# EAGLE design main (EAGLE 9.6.2)
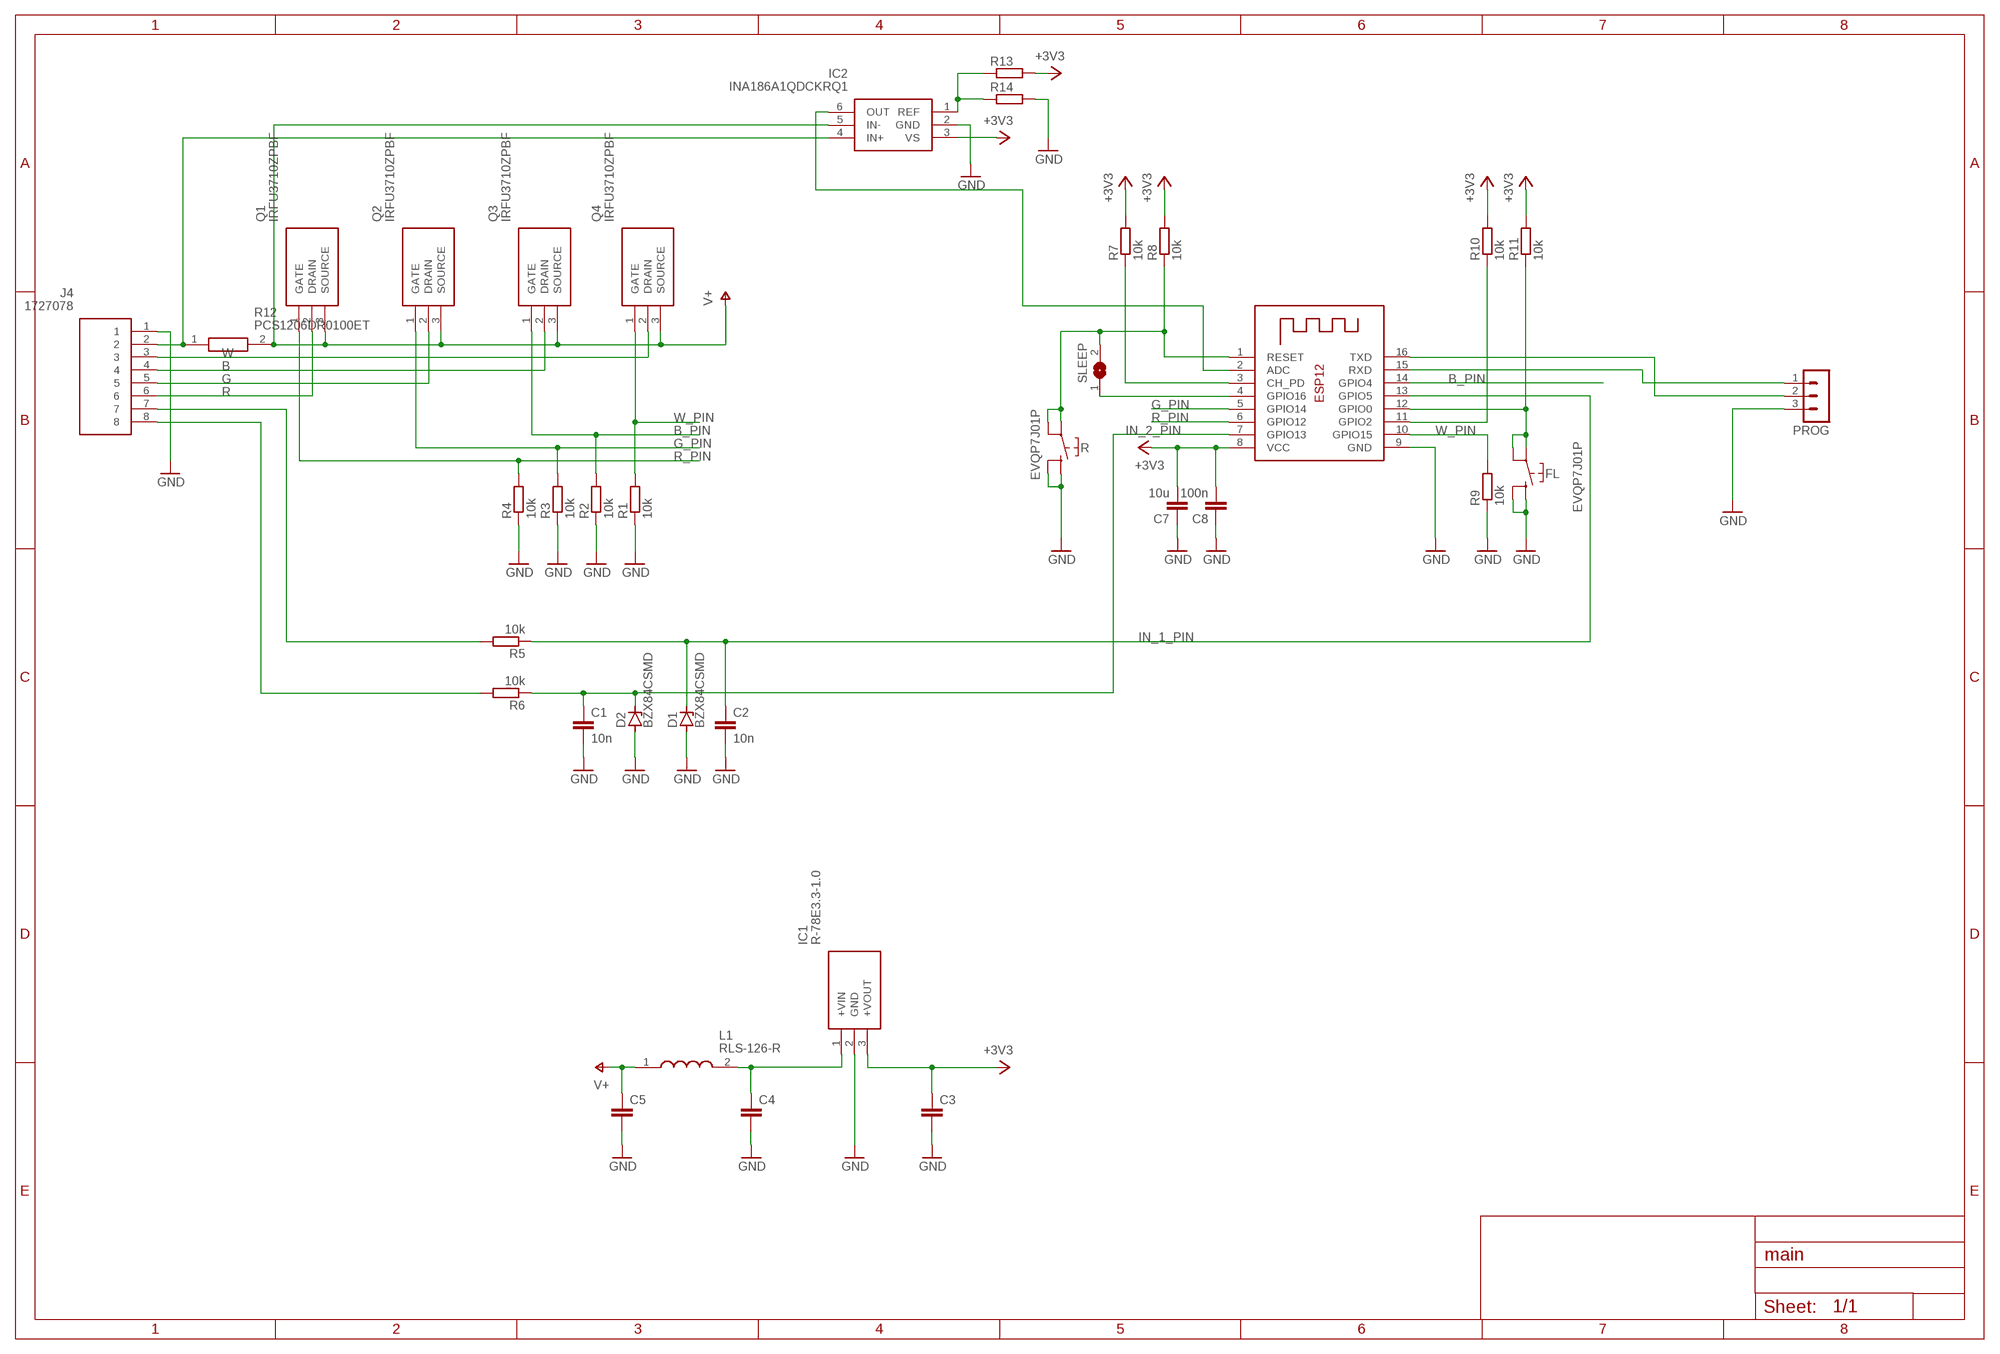
[diagram p0: schematic, sheet 1]

## Parts
C1  10n  C-EUC0603  [C0603]
C2  10n  C-EUC0603  [C0603]
C3  C-EUC0603  [C0603]
C4  C-EUC1206  [C1206]
C5  C-EUC1206  [C1206]
C7  10u  C-EUC0603  [C0603]
C8  100n  C-EUC0603  [C0603]
D1  BZX84CSMD  [TO236]
D2  BZX84CSMD  [TO236]
FL  EVQP7J01P  [EVQP7J01P]
IC1  R-78E3.3-1.0  [R78E3310]
IC2  INA186A1QDCKRQ1  [SOP65P210X110-6N]
J4  1727078  [SHDR8W90P0X381_1X8_3047X730X86]
L1  RLS-126-R  [RLS126R]
PROG  MA03-1  [MA03-1]
Q1  IRFU3710ZPBF  [TO229P239X654X978-3P]
Q2  IRFU3710ZPBF  [TO229P239X654X978-3P]
Q3  IRFU3710ZPBF  [TO229P239X654X978-3P]
Q4  IRFU3710ZPBF  [TO229P239X654X978-3P]
R  EVQP7J01P  [EVQP7J01P]
R1  10k  R-EU_R0603  [R0603]
R2  10k  R-EU_R0603  [R0603]
R3  10k  R-EU_R0603  [R0603]
R4  10k  R-EU_R0603  [R0603]
R5  10k  R-EU_R0603  [R0603]
R6  10k  R-EU_R0603  [R0603]
R7  10k  R-EU_R0603  [R0603]
R8  10k  R-EU_R0603  [R0603]
R9  10k  R-EU_R0603  [R0603]
R10  10k  R-EU_R0603  [R0603]
R11  10k  R-EU_R0603  [R0603]
R12  PCS1206DR0100ET  [RESC3216X68N]
R13  R-EU_R0402  [R0402]
R14  R-EU_R0402  [R0402]
SLEEP  SJ  [SJ]
X2  ESP-12  [ESP-12]

## Nets
+3V3: C3.1 C7.2 C8.2 IC1.3(+VOUT) IC2.3(VS) R7.2 R8.2 R10.2 R11.2 R13.2 X2.8(VCC)
B: J4.4 Q3.2(DRAIN)
B_PIN: Q3.1(GATE) R2.2 X2.14(GPIO4)
G: J4.5 Q2.2(DRAIN)
G_PIN: Q2.1(GATE) R3.2 X2.5(GPIO14)
GND: C1.2 C2.2 C3.2 C4.2 C5.2 C7.1 C8.1 D1.A D2.A FL.A2(COM_1) FL.B2(COM_2) IC1.2(GND) IC2.2(GND) J4.1 PROG.3 R1.1 R2.1 R3.1 R4.1 R9.1 R14.2 R.A2(COM_1) R.B2(COM_2) X2.9(GND)
IN_1_PIN: C2.1 D1.C R5.1 X2.13(GPIO5)
IN_2_PIN: C1.1 D2.C R6.1 X2.7(GPIO13)
N$1: IC2.6(OUT) X2.2(ADC)
N$3: R8.1 R.A1(NO_1) R.B1(NO_2) SLEEP.2 X2.1(RESET)
N$4: J4.7 R5.2
N$5: J4.8 R6.2
N$6: PROG.1 X2.15(RXD)
N$7: IC2.4(IN+) J4.2 R12.1
N$8: IC2.1(REF) R13.1 R14.1
N$9: C4.1 IC1.1(+VIN) L1.2
N$10: R7.1 X2.3(CH_PD)
N$11: R10.1 X2.11(GPIO2)
N$13: FL.A1(NO_1) FL.B1(NO_2) R11.1 X2.12(GPIO0)
N$17: PROG.2 X2.16(TXD)
N$21: SLEEP.1 X2.4(GPIO16)
R: J4.6 Q1.2(DRAIN)
R_PIN: Q1.1(GATE) R4.2 X2.6(GPIO12)
V+: C5.1 IC2.5(IN-) L1.1 Q1.3(SOURCE) Q2.3(SOURCE) Q3.3(SOURCE) Q4.3(SOURCE) R12.2
W: J4.3 Q4.2(DRAIN)
W_PIN: Q4.1(GATE) R1.2 R9.2 X2.10(GPIO15)

## Library data of the parts
C1-C5 C7 C8 = rcl:C-EU: CAPACITOR, European symbol; SPICEPREFIX: C
D1 D2 = diode:BZX84CSMD: Z DIODE
FL R = SamacSys_Parts:EVQP7J01P: PANASONIC - EVQP7J01P - TACTILE SW, SPST-NO, 0.05A, 12V, SMD Source: Datasheet <https://www.arrow.com/en/products/evq-p7j01p/panasonic>; ARROW_PART_NUMBER: EVQP7J01P; ARROW_PRICE-STOCK: https://www.arrow.com/en/products/evq-p7j01p/panasonic; DESCRIPTION: PANASONIC - EVQP7J01P - TACTILE SW, SPST-NO, 0.05A, 12V, SMD; HEIGHT: 1.35mm; MANUFACTURER_NAME: Panasonic; MANUFACTURER_PART_NUMBER: EVQP7J01P
IC1 = SamacSys_Parts:R-78E3.3-1.0: Recom DC-DC Switching Regulator, 7 28V dc Input, 3.3V Output, 1A Source: Datasheet <https://componentsearchengine.com/Datasheets/1/R-78E3.3-1.0.pdf>; ARROW_PART_NUMBER: R-78E3.3-1.0; ARROW_PRICE-STOCK: https://www.arrow.com/en/products/r-78e3.3-1.0/recom-power; DESCRIPTION: Recom DC-DC Switching Regulator, 7 28V dc Input, 3.3V Output, 1A; HEIGHT: 10.9mm; MANUFACTURER_NAME: RECOM Power; MANUFACTURER_PART_NUMBER: R-78E3.3-1.0; MOUSER_PART_NUMBER: 919-R-78E3.3-1.0; MOUSER_PRICE-STOCK: https://www.mouser.co.uk/ProductDetail/RECOM-Power/R-78E33-10/?qs=D0iH%252BVFiYPOgLjjtWWnV0Q%3D%3D
IC2 = SamacSys_Parts:INA186A1QDCKRQ1: Automotive, 40V, low- and high-side current sense amplifier with picoamp bias current Source: Datasheet <http://www.ti.com/lit/gpn/INA186-Q1>; ARROW_PART_NUMBER: INA186A1QDCKRQ1; ARROW_PRICE-STOCK: https://www.arrow.com/en/products/ina186a1qdckrq1/texas-instruments; DESCRIPTION: Automotive, 40V, low- and high-side current sense amplifier with picoamp bias current; HEIGHT: 1.1mm; MANUFACTURER_NAME: Texas Instruments; MANUFACTURER_PART_NUMBER: INA186A1QDCKRQ1; MOUSER_PART_NUMBER: 595-INA186A1QDCKRQ1; MOUSER_PRICE-STOCK: https://www.mouser.co.uk/ProductDetail/Texas-Instruments/INA186A1QDCKRQ1/?qs=Zz7%252BYVVL6bFPAZkek6GrLQ%3D%3D
J4 = SamacSys_Parts_PHOENIX:1727078: 3.81mm pitch,vertical mount,PCB,screw terminal,8way Source: Datasheet <https://www.phoenixcontact.com/online/portal/gb?uri=pxc-oc-itemdetail:pid=1727078&library=gben&tab=1>; ALLIED_NUMBER: 70054363; ALLIED_PRICE-STOCK: https://www.alliedelec.com/phoenix-contact-1727078/70054363/; DESCRIPTION: 3.81mm pitch,vertical mount,PCB,screw terminal,8way; HEIGHT: 8.65mm; MANUFACTURER_NAME: Phoenix Contact; MANUFACTURER_PART_NUMBER: 1727078; MOUSER_PART_NUMBER: 651-1727078; MOUSER_PRICE-STOCK: https://www.mouser.com/Search/Refine.aspx?Keyword=651-1727078; RS_PART_NUMBER: 2204399; RS_PRICE-STOCK: https://uk.rs-online.com/web/p/products/2204399
L1 = SamacSys_Parts:RLS-126-R: Fixed Inductors Line Inductors for RECOM Power Supply Source: Datasheet <https://componentsearchengine.com/Datasheets/1/RLS-126-R.pdf>; ARROW_PART_NUMBER: RLS-126-R; ARROW_PRICE-STOCK: https://www.arrow.com/en/products/rls-126-r/recom-power; DESCRIPTION: Fixed Inductors Line Inductors for RECOM Power Supply; HEIGHT: 3.1mm; MANUFACTURER_NAME: RECOM Power; MANUFACTURER_PART_NUMBER: RLS-126-R; MOUSER_PART_NUMBER: 919-RLS-126-R; MOUSER_PRICE-STOCK: https://www.mouser.co.uk/ProductDetail/RECOM-Power/RLS-126-R/?qs=gZXFycFWdAPAKiXpeP%2FMQg%3D%3D
PROG = con-lstb:MA03-1: PIN HEADER; OC_FARNELL: unknown; OC_NEWARK: unknown
Q1-Q4 = SamacSys_Parts:IRFU3710ZPBF: MOSFET N-Channel 100V 56A HEXFET IPAK Infineon IRFU3710ZPBF N-channel MOSFET Transistor, 56 A, 100 V, 3-Pin IPAK Source: Datasheet <http://uk.rs-online.com/web/p/products/6887131>; DESCRIPTION: MOSFET N-Channel 100V 56A HEXFET IPAK Infineon IRFU3710ZPBF N-channel MOSFET Transistor, 56 A, 100 V, 3-Pin IPAK; HEIGHT: 2.39mm; MANUFACTURER_NAME: Infineon; MANUFACTURER_PART_NUMBER: IRFU3710ZPBF; MOUSER_PART_NUMBER: 942-IRFU3710ZPBF; MOUSER_PRICE-STOCK: https://www.mouser.co.uk/ProductDetail/Infineon-IR/IRFU3710ZPBF/?qs=9%252BKlkBgLFf3NyWsRABCVig%3D%3D
R1-R11 R13 R14 = rcl:R-EU_: RESISTOR, European symbol; SPICEPREFIX: R
R12 = SamacSys_Parts:PCS1206DR0100ET: Current Sense Resistors - SMD 1W 0.010 OHMS 0.5% Source: Datasheet <https://componentsearchengine.com//PCS1206DR0100ET.pdf>; DESCRIPTION: Current Sense Resistors - SMD 1W 0.010 OHMS 0.5%; HEIGHT: 0.684mm; MANUFACTURER_NAME: Ohmite; MANUFACTURER_PART_NUMBER: PCS1206DR0100ET; MOUSER_PART_NUMBER: 588-PCS1206DR0100ET; MOUSER_PRICE-STOCK: https://www.mouser.co.uk/ProductDetail/Ohmite/PCS1206DR0100ET/?qs=Zz7%252BYVVL6bH%2F2nwIEMOhrA%3D%3D
SLEEP = jumper:SJ: SMD solder JUMPER
X2 = adafruit:ESP-12

## Board
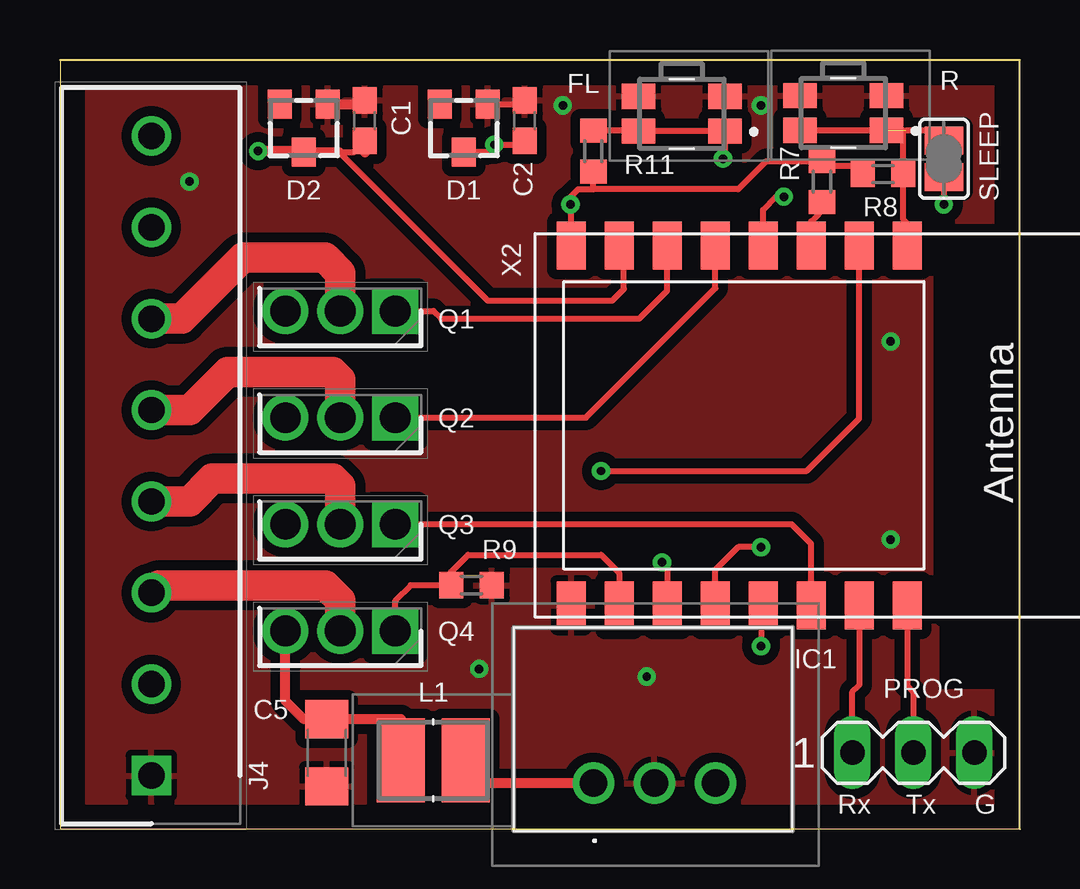
[diagram p1: board, top side]
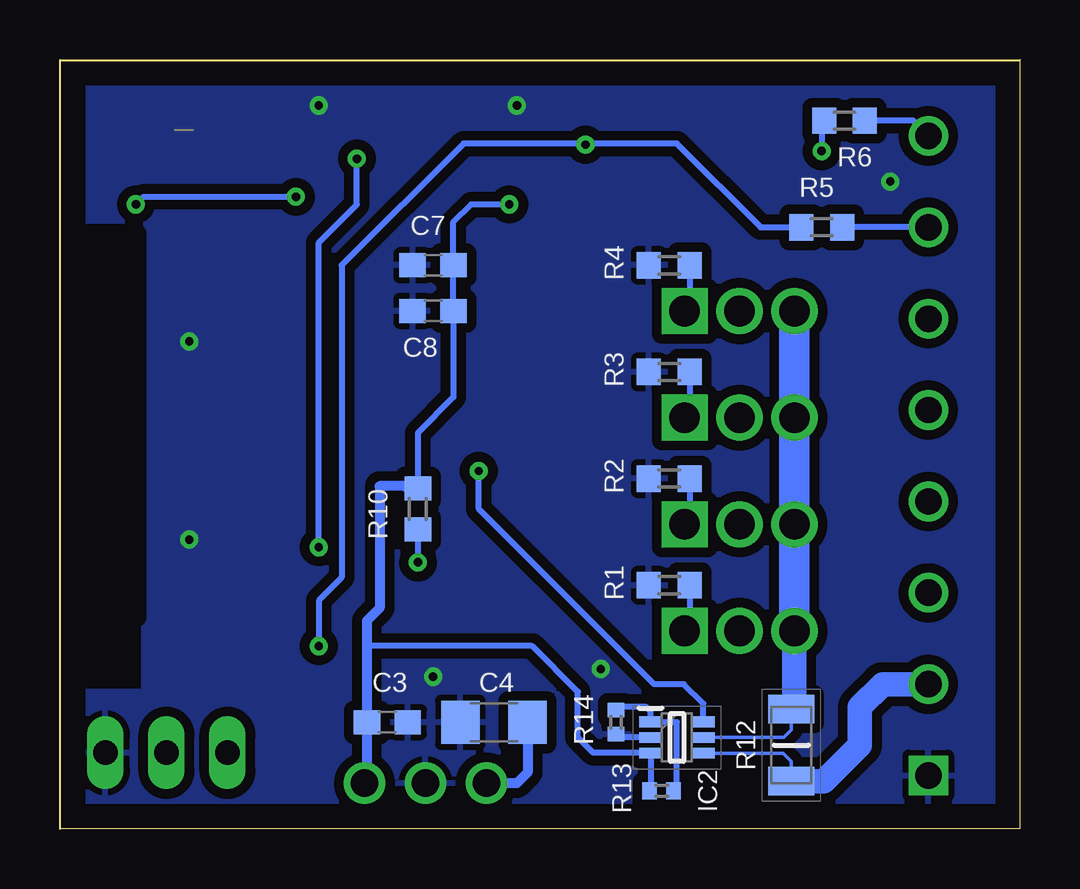
[diagram p2: board, bottom side, seen from below]

Size 39.99 x 32.06 mm. Coordinates in mm from the lower left corner, seen from the top.
Outline: 0,0 39.99,0 39.99,32.06 0,32.06 0,0
Copper layers (1*16): Top 0.035mm / dielectric 1.5mm / Bottom 0.035mm
Design rules "default": minimum track width 6mil, minimum drill 0.35mm, track to track 6mil, track to pad 6mil, pad to pad 6mil, via to via 6mil, smd to smd 6mil, copper to edge 40mil, drill to drill 6mil, minimum pad ring 10mil, minimum via ring 8mil, stop-mask expansion 4mil, vias tented up to drill 0mil, thermal gap 10mil

### Footprints (pad centres in the part's own frame; a part is rotated, then mirrored left to right if it is on the bottom)
C0603 = smd 1.1 x 1: 1 -0.85,0; 2 0.85,0
C1206 = smd 1.6 x 1.8: 1 -1.4,0; 2 1.4,0
TO236 = smd 1 x 1.2: A -1,-1; C 0,1; NC 1,-1
EVQP7J01P = smd 1.4 x 1.05: A1 -1.8,0.725; A2 -1.8,-0.725; B1 1.8,0.725; B2 1.8,-0.725
R78E3310 = drill 1.15 pad 1.725: 1 0,0; 2 2.54,0; 3 5.08,0
SOP65P210X110-6N = smd 0.95 x 0.45: 1 -1.1,0.65; 2 -1.1,0; 3 -1.1,-0.65; 4 1.1,-0.65; 5 1.1,0; 6 1.1,0.65
SHDR8W90P0X381_1X8_3047X730X86 = drill 1.1 pad 1.65 square: 1 0,0 | drill 1.1 pad 1.65: 2 3.81,0; 3 7.62,0; 4 11.43,0; 5 15.24,0; 6 19.05,0; 7 22.86,0; 8 26.67,0
RLS126R = smd 2 x 3.5: 1 -1.35,0; 2 1.35,0
MA03-1 = drill 1.016 long: 1 -2.54,0; 2 0,0; 3 2.54,0
TO229P239X654X978-3P = drill 1.28 pad 1.92 square: 1 0,0 | drill 1.28 pad 1.92: 2 2.29,0; 3 4.58,0
R0603 = smd 1 x 1.1: 1 -0.85,0; 2 0.85,0
RESC3216X68N = smd 1.2 x 1.9: 1 -1.5,0; 2 1.5,0
R0402 = smd 0.6 x 0.7: 1 -0.5,0; 2 0.5,0
SJ = smd 1.168 x 1.6: 1 -0.762,0; 2 0.762,0
ESP-12 = smd 2 x 1.2: 1 -7.5,4.5; 2 -7.5,2.5; 3 -7.5,0.5; 4 -7.5,-1.5; 5 -7.5,-3.5; 6 -7.5,-5.5; 7 -7.5,-7.5; 8 -7.5,-9.5; 9 7.5,-9.5; 10 7.5,-7.5; 11 7.5,-5.5; 12 7.5,-3.5; 13 7.5,-1.5; 14 7.5,0.5; 15 7.5,2.5; 16 7.5,4.5

### Placement (x,y rotation side)
C1  12.7,29.53 90 top
C2  19.37,29.53 90 top
C3  26.35,4.45 0 bottom
C4  21.91,4.45 180 bottom
C5  11.11,3.17 270 top
C7  24.45,23.5 0 bottom
C8  24.45,21.59 0 bottom
D1  16.83,29.21 180 top
D2  10.16,29.21 180 top
FL  25.91,29.81 180 top
IC1  22.23,1.91 0 top
IC2  14.29,3.81 0 bottom
J4  3.81,2.22 90 top
L1  15.56,2.86 0 top
PROG  35.56,3.17 0 top
Q1  13.97,21.59 180 top
Q2  13.97,17.14 180 top
Q3  13.97,12.7 180 top
Q4  13.97,8.26 180 top
R  32.64,29.84 180 top
R1  14.61,10.16 0 bottom
R2  14.61,14.61 0 bottom
R3  14.61,19.05 0 bottom
R4  14.61,23.5 0 bottom
R5  8.26,25.08 0 bottom
R6  7.3,29.53 0 bottom
R7  31.75,26.99 90 top
R8  34.29,27.3 180 top
R9  17.14,10.16 180 top
R10  25.08,13.34 90 bottom
R11  22.23,28.26 270 top
R12  9.53,3.49 90 bottom
R13  14.92,1.59 180 bottom
R14  16.83,4.45 270 bottom
SLEEP  36.83,27.94 90 top
X2  30.8,16.83 270 top

### Tracks (layer width: path | path; a pad name or v marks a point on that pad's centre or on a via)
+3V3  (via drill 0.35)
  Top 0.254: X2.8 21.27,24.35 v21.27,26.04 21.27,26.35 21.59,26.67 22.23,26.67 | R8.2 33.12,27.62 31.96,27.62 R7.2 29.43,27.84 28.26,26.67 22.23,26.67 | 22.23,26.67 R11.2
  Bottom 0.254: v21.27,26.04 22.86,26.04 23.6,25.3 C7.2 C8.2 23.6,18 25.08,16.51 R10.2 | R13.2 15.39,1.62 IC2.3 15.4,3.17 17.78,3.17 18.41,3.81 18.41,5.71 20.32,7.62 27.2,7.62
  Bottom 0.406: R10.2 25.51,14.19 25.61,14.29 26.67,14.29 26.67,9.21 27.2,8.68 27.2,7.62 C3.1 27.2,2.01 IC1.3
B
  Top 1.27: J4.4 5.4,13.65 6.35,14.61 11.36,14.61 11.68,14.29 Q3.2
B_PIN
  Top 0.254: Q3.1 30.48,12.7 31.3,11.88 X2.14
  Top 0.406: 31.11,9.14 X2.14
  Bottom 0.254: Q3.1 13.76,12.91 R2.2
G
  Top 1.27: Q2.2 11.68,18.73 11.36,19.05 6.99,19.05 5.4,17.46 J4.5
G_PIN
  Top 0.254: X2.5 27.3,22.54 21.91,17.14 Q2.1
  Bottom 0.254: Q2.1 13.76,17.36 R3.2
GND  (via drill 0.35)
  Top 0.254: D1.A 19.2,30.21 C2.2
  Top 0.406: D2.A 12.53,30.21 C1.2
  Bottom 0.254: R14.2 16.69,3.81 IC2.2
  other vias: 20.95,30.16 29.21,30.16 5.4,26.99 34.61,20.32 34.61,12.06 17.46,6.67 24.45,6.35
  pour Top (isolate 0.406): 0,32.07 40.01,32.07 40.01,24.13 36.51,24.13 36.51,5.71 40.01,5.71 40.01,0 0,0
  pour Bottom (isolate 0.406): 0,32.07 40.01,32.07 40.01,24.13 36.51,24.13 36.51,5.71 40.01,5.71 40.01,0 0,0
IN_1_PIN  (via drill 0.35)
  Top 0.254: D1.C 17.78,28.21 v18.1,28.53 19.22,28.53 C2.1 | X2.13 29.21,9.24 v29.21,7.62
  Bottom 0.254: R5.1 10.79,25.08 14.29,28.57 18.1,28.57 | 18.1,28.57 23.18,28.57 28.26,23.5 28.26,10.48 29.21,9.53 v29.21,7.62 | v18.1,28.53 18.1,28.57
IN_2_PIN  (via drill 0.35)
  Top 0.254: 11.64,28.21 17.83,22.02 23,22.02 23.5,22.51 23.5,24.13 X2.7 | D2.C 12.23,28.21 C1.1
  Top 0.406: 11.64,28.21 D2.C 10.11,28.26 v8.26,28.26 | C1.1 12.7,28.21
  Bottom 0.254: R6.1 8.26,29.43 v8.26,28.26
N$1  (via drill 0.35)
  Top 0.254: v22.54,14.92 31.11,14.92 33.3,17.11 X2.2
  Bottom 0.254: IC2.6 13.19,5.23 13.99,6.03 15.24,6.03 22.54,13.34 v22.54,14.92
N$3  (1 unrouted)
  Top 0.254: 36.9,28.82 SLEEP.2 36.83,29.12 35.24,29.12 | X2.1 35.3,25.24 35.14,25.4 R8.1 35.14,29.12 R.A1 R.B1
N$4
  Bottom 0.254: J4.7 R5.2
N$5
  Bottom 0.254: J4.8 4.45,29.53 R6.2
N$6
  Top 0.254: X2.15 33.3,5.99 33.02,5.71 PROG.1
N$7
  Bottom 0.152: IC2.4 9.86,3.16 9.53,2.83 R12.1
  Bottom 1.016: J4.2 5.71,6.03 6.67,5.08 6.67,3.49 8.17,1.99 R12.1
N$8
  Bottom 0.254: R13.1 14.29,1.72 14.29,4.45 14.3,4.46 IC2.1 15.39,4.91 15.56,5.08 16.69,5.08 R14.1
N$9
  Top 0.406: IC1.1 17.14,1.91 16.83,2.22 16.83,2.78 L1.2
  Bottom 0.406: C4.1 20.51,2.35 20.95,1.91 IC1.1
N$10
  Top 0.254: 31.3,25 X2.3 31.3,25.32 31.93,25.95 R7.1
N$11  (via drill 0.35)
  Top 0.254: v25.08,11.11 25.3,10.9 X2.11
  Bottom 0.254: R10.1 v25.08,11.11
N$13  (via drill 0.35)
  Top 0.254: v27.62,27.94 27.71,28.03 FL.A1 FL.B1 24.09,29.11 R11.1 | X2.12 27.3,10.79 28.26,11.75 v29.21,11.75
  Bottom 0.254: v29.21,11.75 29.21,24.45 27.62,26.04 v27.62,27.94
N$17
  Top 0.254: X2.16 35.3,5.98 35.56,5.71 PROG.2
  Top 0.406: 35.24,9.27 X2.16
N$21  (via drill 0.35)
  Top 0.254: 29.21,24.41 X2.4 29.3,25.8 29.84,26.35 v30.16,26.35 | SLEEP.1 v36.83,26.04
  Bottom 0.254: v30.16,26.35 36.51,26.35 v36.83,26.04
R
  Top 1.27: Q1.2 11.68,23.18 11.04,23.81 7.62,23.81 5.08,21.27 J4.6
R_PIN
  Top 0.254: Q1.1 15.56,21.59 15.88,21.27 24.13,21.27 25.3,22.44 X2.6
  Bottom 0.254: R4.2 13.76,21.8 Q1.1
V+
  Top 0.406: 9.21,8.07 Q4.3 9.39,5.34 10.16,4.58 C5.1 14.21,4.58 L1.1
  Bottom 0.152: R12.2 9.53,4.13 9.84,3.81 IC2.5
  Bottom 1.016: R12.2 9.39,5.13 Q4.3
  Bottom 1.27: Q4.3 Q3.3 Q2.3 Q1.3
W
  Top 1.27: Q4.2 11.68,9.53 11.04,10.16 4.13,10.16 J4.3
W_PIN
  Top 0.254: X2.10 23.3,10.68 22.54,11.43 17.01,11.43 16.3,10.72 R9.2 14.61,10.16 13.97,9.53 Q4.1
  Bottom 0.254: Q4.1 13.76,8.47 R1.2

### Text on the board
tNames: Rx | Tx | G